# EAGLE design Proto_Shield (EAGLE 6.4)
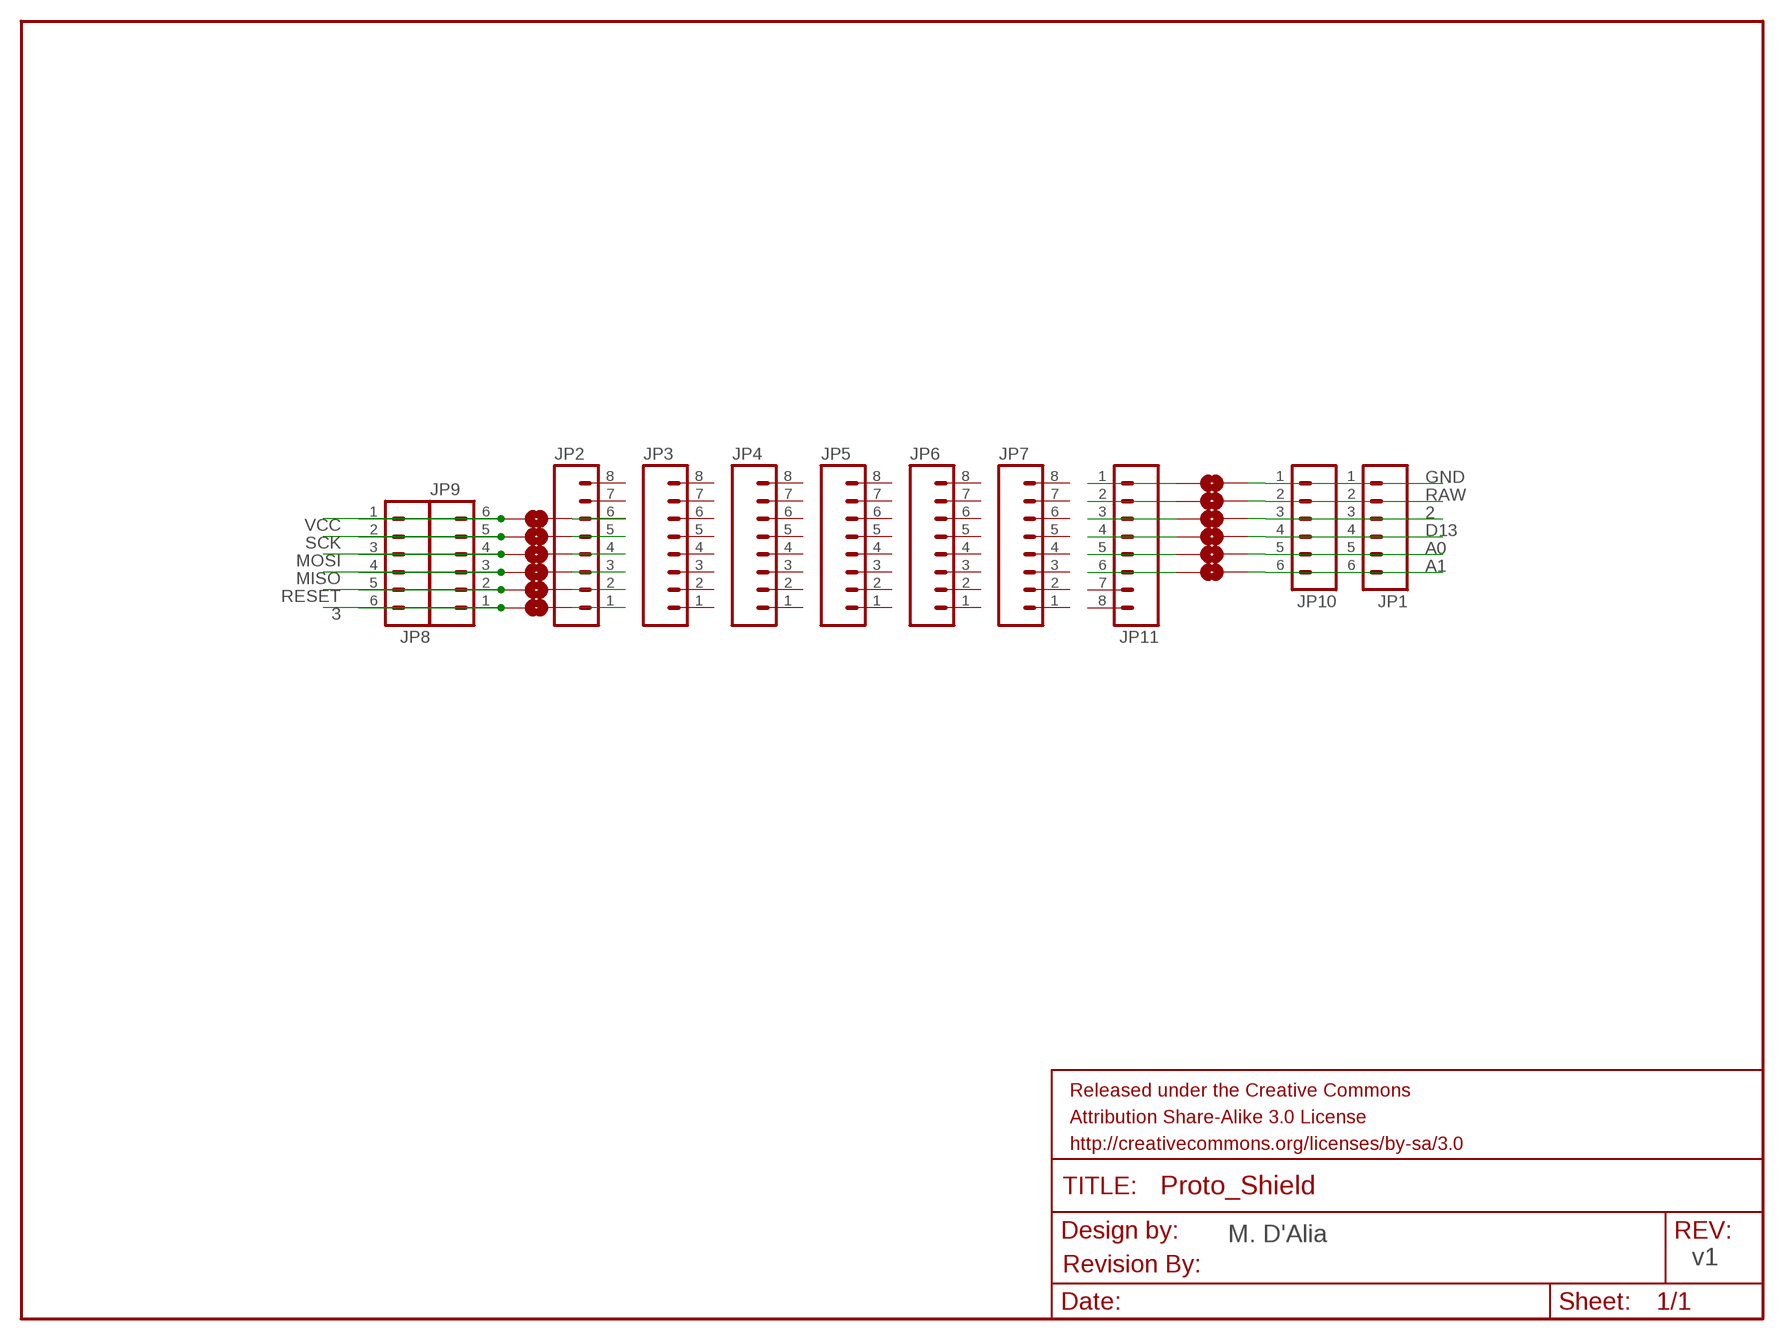
[diagram p0: schematic, sheet 1]

## Parts
FRAME1  FRAME-LETTER  [CREATIVE_COMMONS]
JP1  M06SMD-STRAIGHT  [1X06_SMD_STRAIGHT]
JP2  M08NO_SILK  [1X08_NO_SILK]
JP3  M08NO_SILK  [1X08_NO_SILK]
JP4  M08NO_SILK  [1X08_NO_SILK]
JP5  M08NO_SILK  [1X08_NO_SILK]
JP6  M08NO_SILK  [1X08_NO_SILK]
JP7  M08NO_SILK  [1X08_NO_SILK]
JP8  M06SMD-STRAIGHT-ALT-NOSILK  [1X06_SMD_STRAIGHT_ALT_NOSILK]
JP9  M06LOCK_LONGPADS  [1X06_LOCK_LONGPADS]
JP10  M06LOCK_LONGPADS  [1X06_LOCK_LONGPADS]
JP11  M08NO_SILK  [1X08_NO_SILK]
SJ1  SOLDERJUMPERTRACE  [SJ_2S-TRACE]
SJ2  SOLDERJUMPERTRACE  [SJ_2S-TRACE]
SJ3  SOLDERJUMPERTRACE  [SJ_2S-TRACE]
SJ4  SOLDERJUMPERTRACE  [SJ_2S-TRACE]
SJ5  SOLDERJUMPERTRACE  [SJ_2S-TRACE]
SJ6  SOLDERJUMPERTRACE  [SJ_2S-TRACE]
SJ7  SOLDERJUMPERTRACE  [SJ_2S-TRACE]
SJ8  SOLDERJUMPERTRACE  [SJ_2S-TRACE]
SJ9  SOLDERJUMPERTRACE  [SJ_2S-TRACE]
SJ10  SOLDERJUMPERTRACE  [SJ_2S-TRACE]
SJ11  SOLDERJUMPERTRACE  [SJ_2S-TRACE]
SJ12  SOLDERJUMPERTRACE  [SJ_2S-TRACE]
U$5  REVISION  [REVISION]

## Nets
2: JP1.3 JP10.3 SJ4.1
3: JP8.6 JP9.1 SJ12.2
A0: JP1.5 JP10.5 SJ2.1
A1: JP1.6 JP10.6 SJ1.1
D13: JP1.4 JP10.4 SJ3.1
GND: JP1.1 JP10.1 SJ6.1
MISO: JP8.4 JP9.3 SJ10.2
MOSI: JP8.3 JP9.4 SJ9.2
N$1: JP11.6 SJ1.2
N$2: JP11.5 SJ2.2
N$3: JP11.4 SJ3.2
N$4: JP11.3 SJ4.2
N$5: JP11.2 SJ5.2
N$6: JP11.1 SJ6.2
N$7: JP2.6 SJ7.1
N$8: JP2.5 SJ8.1
N$9: JP2.4 SJ9.1
N$10: JP2.3 SJ10.1
N$11: JP2.2 SJ11.1
N$12: JP2.1 SJ12.1
RAW: JP1.2 JP10.2 SJ5.1
RESET: JP8.5 JP9.2 SJ11.2
SCK: JP8.2 JP9.5 SJ8.2
VCC: JP8.1 JP9.6 SJ7.2
Unconnected: JP2.7 JP2.8 JP3.1 JP3.2 JP3.3 JP3.4 JP3.5 JP3.6 JP3.7 JP3.8 JP4.1 JP4.2 JP4.3 JP4.4 JP4.5 JP4.6 JP4.7 JP4.8 JP5.1 JP5.2 JP5.3 JP5.4 JP5.5 JP5.6 JP5.7 JP5.8 JP6.1 JP6.2 JP6.3 JP6.4 JP6.5 JP6.6 JP6.7 JP6.8 JP7.1 JP7.2 JP7.3 JP7.4 JP7.5 JP7.6 JP7.7 JP7.8 JP11.7 JP11.8

## Notes on the sheet
- M. D'Alia
- v1

## Library data of the parts
FRAME1 = SparkFun-Aesthetics:FRAME-LETTER: Schematic Frame Standard 8.5x11 US Letter frame
JP1 JP8-JP10 = SparkFun-Connectors:M06: Header 6 Standard 6-pin 0.1" header. Use with straight break away headers (SKU : PRT-00116), right angle break away headers (PRT-00553), swiss pins (PRT-00743), machine pins (PRT-00117), and female headers (PRT-00115). Molex polarized connector foot print use with SKU : PRT-08094 with associated crimp pins and housings. NOTES ON THE VARIANTS LOCK and LOCK_LONGPADS... This footprint was designed to help hold the alignment of a through-hole component (i.e. 6-pin header) while soldering it into place. You may notice that each hole has been shifted either up or down by 0.005 of an inch from it's more standard position (which is a perfectly straight line). This slight alteration caused the pins (the squares in the middle) to touch the edges of the holes. Because they are alternating, it causes a "brace" to hold the component in place. 0.005 has proven to be the perfect amount of "off-center" position when using our standard breakaway headers. Although looks a little odd when you look at the bare footprint, once you have a header in there, the alteration is very hard to notice. Also,if you push a header all the way into place, it is covered up entirely on the bottom side. This idea of altering the position of holes to aid alignment will be further integrated into the Sparkfun Library for other footprints. It can help hold any component with 3 or more connection pins.
JP2-JP7 JP11 = SparkFun-Connectors:M08: Header 8 Standard 8-pin 0.1" header. Use with straight break away headers (SKU : PRT-00116), right angle break away headers (PRT-00553), swiss pins (PRT-00743), machine pins (PRT-00117), and female headers (PRT-00115).
SJ1-SJ12 = SparkFun-Passives:SOLDERJUMPER: Solder Jumper Standard SMD solder jumper. Used to automate production. Two varients : Normally Open and Normally Closed are the same, but have different paste layers. NC will have a large amount of paste and should jumper during reflow.
U$5 = SparkFun-Aesthetics:REVISION

## Net classes
0 Default: width 0.203 mm
1 vcc: width 0.254 mm
2 GND: width 0.813 mm

## Board
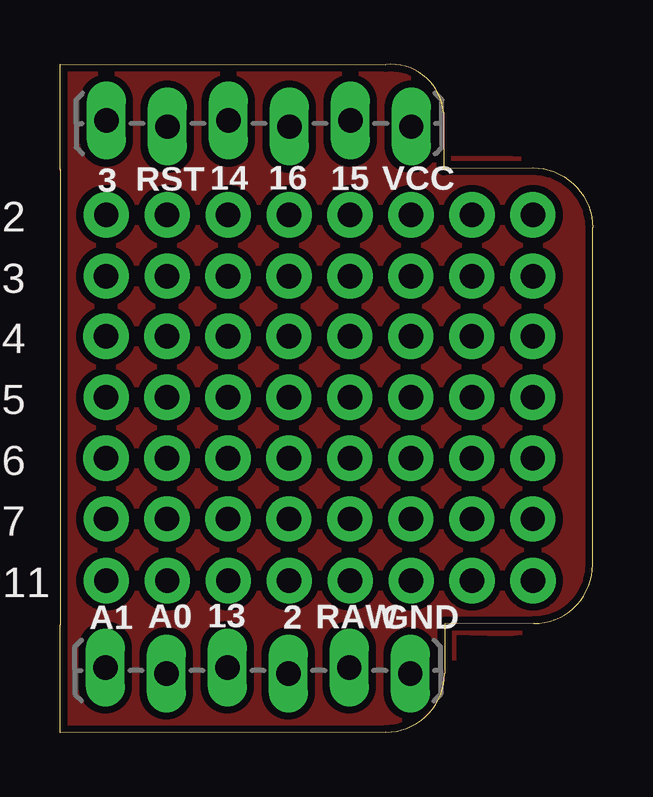
[diagram p1: board, top side]
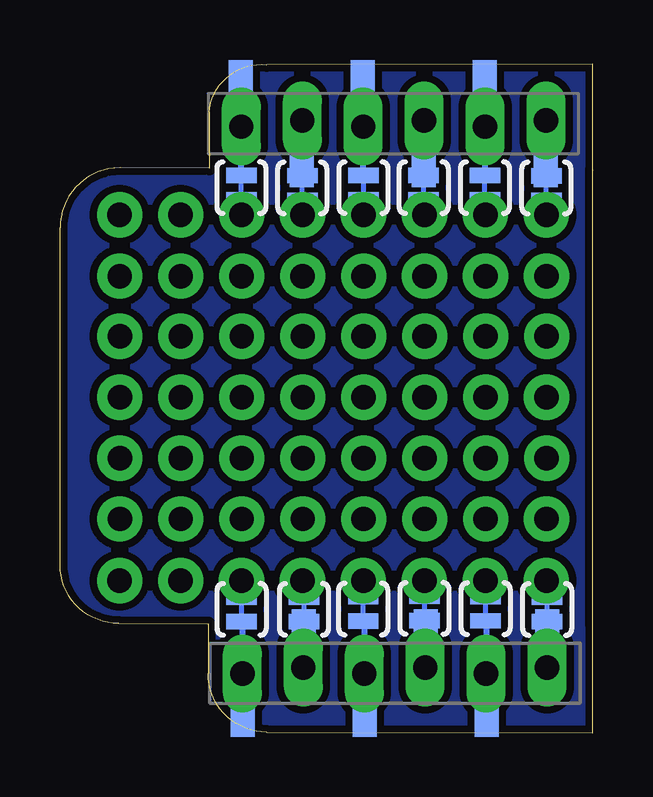
[diagram p2: board, bottom side, seen from below]

Size 22.19 x 27.87 mm. Coordinates in mm from the lower left corner, seen from the top.
Outline: 0.01,23.5 0,23.46 0,27.86 13.58,27.86 arc-90 15.98,25.86 15.98,23.53 19.69,23.55 arc-90 22.19,21.05 22.19,7 arc-90 19.74,4.55 16.02,4.53 16.02,2.47 arc-90 13.57,0.02 0,0 0,4.5 0.01,4.5 0.01,23.5
Copper layers (1*16): Top 0.035mm / dielectric 1.5mm / Bottom 0.035mm
Design rules "SparkFun *": minimum track width 7mil, minimum drill 15mil, track to track 8mil, track to pad 8mil, pad to pad 8mil, via to via 8mil, smd to smd 8mil, copper to edge 8mil, drill to drill 8mil, minimum pad ring 12mil, minimum via ring 10mil, stop-mask expansion 4mil, vias tented up to drill 20mil, thermal gap 10mil
tRestrict: area 4.9,16.3 to 5.1,17

### Footprints (pad centres in the part's own frame; a part is rotated, then mirrored left to right if it is on the bottom)
1X06_SMD_STRAIGHT = smd 1 x 2: 1 0,1.65; 2 -2.54,-1.65; 3 -5.08,1.65; 4 -7.62,-1.65; 5 -10.16,1.65; 6 -12.7,-1.65
1X08_NO_SILK = drill 1.016 pad 1.88: 1 0,0; 2 2.54,0; 3 5.08,0; 4 7.62,0; 5 10.16,0; 6 12.7,0; 7 15.24,0; 8 17.78,0
1X06_SMD_STRAIGHT_ALT_NOSILK = smd 1 x 2: 1 0,-1.65; 2 -2.54,1.65; 3 -5.08,-1.65; 4 -7.62,1.65; 5 -10.16,-1.65; 6 -12.7,1.65
1X06_LOCK_LONGPADS = drill 1.016 long: 1 0,0; 2 2.54,-0.254; 3 5.08,0; 4 7.62,-0.254; 5 10.16,0; 6 12.7,-0.254
SJ_2S-TRACE = smd 0.635 x 1.27: 1 -0.508,0; 2 0.508,0

### Placement (x,y rotation side)
FRAME1  -11.12,-11.91 0 top  (outside the outline)
JP1  1.88,2.48 0 bottom
JP2  1.93,21.59 0 top
JP3  1.92,19.03 0 top
JP4  1.92,16.53 0 top
JP5  1.92,13.98 0 top
JP6  1.92,11.44 0 top
JP7  1.92,8.91 0 top
JP8  14.65,25.4 180 bottom
JP9  1.94,25.52 0 top
JP10  1.89,2.72 0 top
JP11  1.93,6.34 0 top
SJ1  14.62,5.14 90 bottom
SJ2  12.02,5.14 90 bottom
SJ3  9.56,5.15 90 bottom
SJ4  7,5.18 90 bottom
SJ5  4.45,5.17 90 bottom
SJ6  1.89,5.14 90 bottom
SJ7  14.63,22.72 90 bottom
SJ8  12.1,22.71 90 bottom
SJ9  9.55,22.73 90 bottom
SJ10  7.04,22.73 90 bottom
SJ11  4.48,22.73 90 bottom
SJ12  1.93,22.71 90 bottom
U$5  1.05,-15.72 0 top  (outside the outline)

### Tracks (layer width: path | path; a pad name or v marks a point on that pad's centre or on a via)
2
  Bottom 0.254: 6.77,2.69 JP10.3 6.97,3.94 JP1.3 6.96,4.63 SJ4.1
3
  Bottom 0.254: JP9.1 1.8,24.58 JP8.6 1.93,23.72 SJ12.2
A0
  Bottom 0.254: JP1.5 11.85,2.69 JP10.5 12.05,4.6 SJ2.1
A1
  Bottom 0.254: JP1.6 14.39,2.4 JP10.6 14.59,4.61 SJ1.1
D13
  Bottom 0.254: JP1.4 9.31,2.4 JP10.4 9.51,4.61 SJ3.1
GND
  Bottom 0.254: JP1.1 1.89,3.94 JP10.1 SJ6.1
MISO
  Bottom 0.254: JP9.3 7.02,23.76 JP8.4 SJ10.2
MOSI
  Bottom 0.254: JP8.3 9.56,25.71 JP9.4 9.56,23.25 SJ9.2
N$1
  Bottom 0.254: JP11.6 SJ1.2
N$2
  Bottom 0.254: JP11.5 12.02,6.28 SJ2.2
N$3
  Bottom 0.254: JP11.4 SJ3.2
N$4
  Bottom 0.254: JP11.3 SJ4.2
N$5
  Bottom 0.254: SJ5.2 4.47,5.69 JP11.2
N$6
  Bottom 0.254: SJ6.2 1.93,5.68 JP11.1
N$7
  Bottom 0.254: JP2.6 SJ7.1
N$8
  Bottom 0.254: JP2.5 12.1,21.6 SJ8.1
N$9
  Bottom 0.254: JP2.4 SJ9.1
N$10
  Bottom 0.254: JP2.3 7.04,21.62 SJ10.1
N$11
  Bottom 0.254: JP2.2 4.48,21.61 SJ11.1
N$12
  Bottom 0.254: JP2.1 SJ12.1
NUL
  pour Bottom (isolate 0.305): -0.14,28 -0.06,-0.24 13.87,0 arc89 16.14,2.31 16.14,4.38 19.26,4.34 arc91 22.26,7.31 22.26,21.19 arc89 19.77,23.7 16.03,23.74 16,25.98 arc89 14.03,27.93
  pour Top (isolate 0.305): -0.03,27.9 -0.08,-0.09 13.02,-0.2 arc88 16.4,3.16 16.41,4.2 18.49,4.15 arc91 22.49,8.04 22.51,20.22 arc90 18.84,23.92 16.22,23.93 16.25,24.83 arc92 13.1,27.99
RAW
  Bottom 0.254: JP1.2 4.23,2.4 JP10.2 4.43,4.64 SJ5.1
RESET
  Bottom 0.254: JP8.5 4.46,25.61 JP9.2 SJ11.2
SCK
  Bottom 0.254: JP9.5 12.08,25.01 JP8.2 12.11,23.24 SJ8.2
VCC
  Bottom 0.254: JP8.1 14.64,25.68 JP9.6 SJ7.2

### Text on the board
tPlace: 3 | RST | 14 | 16 | 15 | VCC | A0 | 2 | A1 | 13 | RAW | GND
tValues: Marco D'Alia